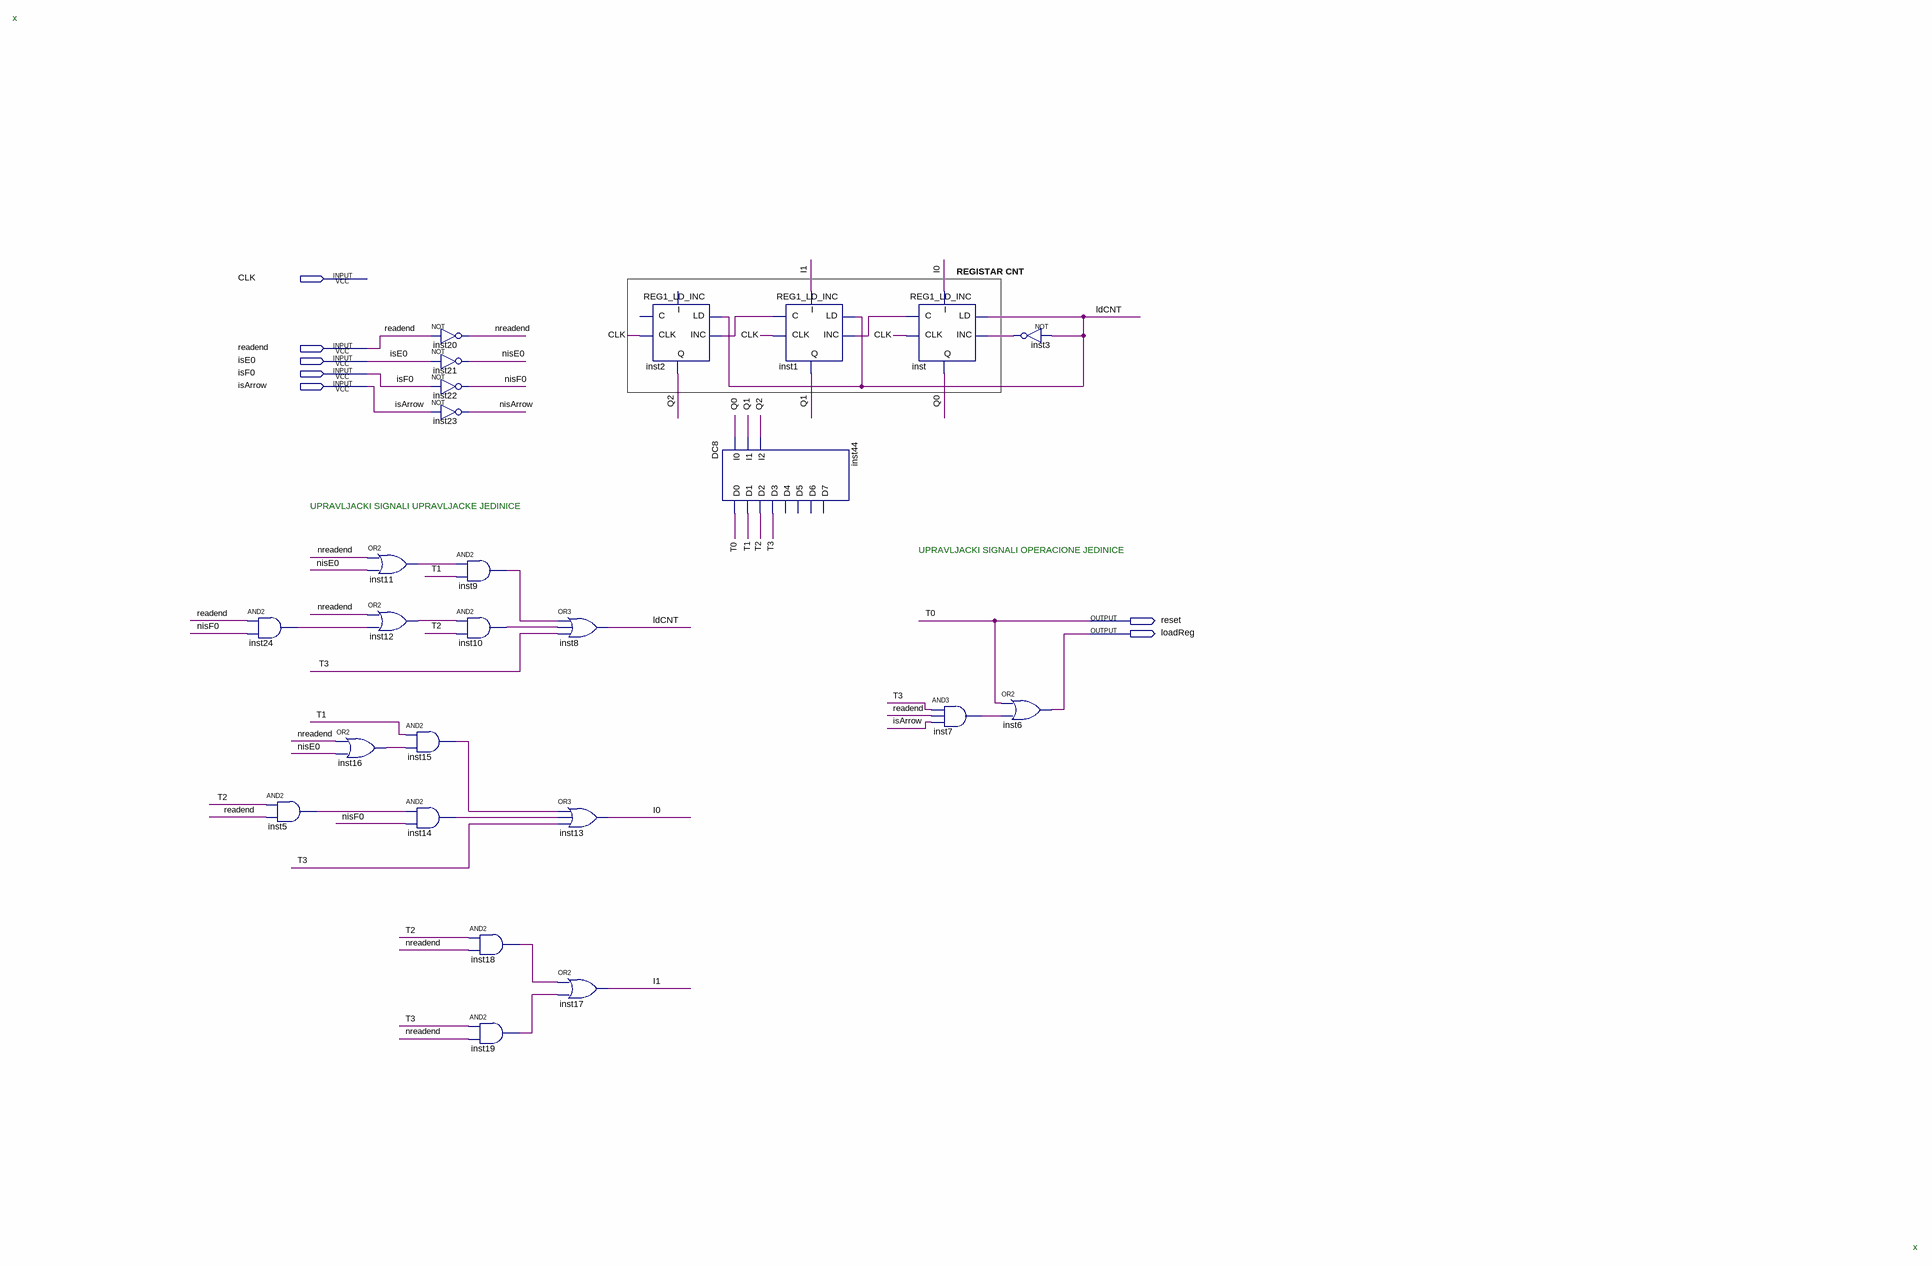
[diagram p0: schematic sheet]
// Quartus schematic KEY_DECODER_UP.bdf as structural Verilog: 25 symbols, 7 pins
module KEY_DECODER_UP (
  input  CLK,
  input  readend,
  input  isE0,
  input  isF0,
  input  isArrow,
  output reset,
  output loadReg
);

  wire I0, I1, inst1_c, inst3_out, inst5_out, inst7_out, inst9_out, inst10_out, inst11_out, inst12_out,
       inst14_out, inst15_out, inst16_out, inst18_out, inst19_out, inst24_out, inst_c, ldCNT, nisArrow,
       nisE0, nisF0, nreadend, Q0, Q1, Q2, T1, T2, T3;

  and inst24 (inst24_out, readend, nisF0);
  and inst5 (inst5_out, T2, readend);
  or inst16 (inst16_out, nreadend, nisE0);
  or inst11 (inst11_out, nreadend, nisE0);
  or inst12 (inst12_out, nreadend, inst24_out);
  not inst20 (nreadend, readend);
  not inst21 (nisE0, isE0);
  not inst22 (nisF0, isF0);
  not inst23 (nisArrow, isArrow);
  and inst15 (inst15_out, T1, inst16_out);
  and inst14 (inst14_out, inst5_out, nisF0);
  and inst9 (inst9_out, inst11_out, T1);
  and inst10 (inst10_out, inst12_out, T2);
  and inst18 (inst18_out, T2, nreadend);
  and inst19 (inst19_out, T3, nreadend);
  or inst8 (ldCNT, inst9_out, inst10_out, T3);
  or inst13 (I0, inst15_out, inst14_out, T3);
  or inst17 (I1, inst18_out, inst19_out);
  REG1_LD_INC inst2 (.LD(ldCNT), .INC(inst1_c), .CLK(CLK), .Q(Q2));  // open: I, C
  DC8 inst44 (.I0(Q0), .I1(Q1), .I2(Q2), .D0(reset), .D1(T1), .D2(T2), .D3(T3));  // open: D4, D5, D6, D7
  REG1_LD_INC inst1 (.I(I1), .LD(ldCNT), .INC(inst_c), .CLK(CLK), .Q(Q1), .C(inst1_c));
  REG1_LD_INC inst (.I(I0), .LD(ldCNT), .INC(inst3_out), .CLK(CLK), .Q(Q0), .C(inst_c));
  and inst7 (inst7_out, T3, readend, isArrow);
  not inst3 (inst3_out, ldCNT);
  or inst6 (loadReg, reset, inst7_out);

  // Other names for the same wires on the sheet: T0 = reset

  // Notes on the sheet:
  //   x
  //   REGISTAR CNT
  //   UPRAVLJACKI SIGNALI UPRAVLJACKE JEDINICE
  //   UPRAVLJACKI SIGNALI OPERACIONE JEDINICE
  //   x
endmodule
